# Altium project valves_v2.PrjPcb
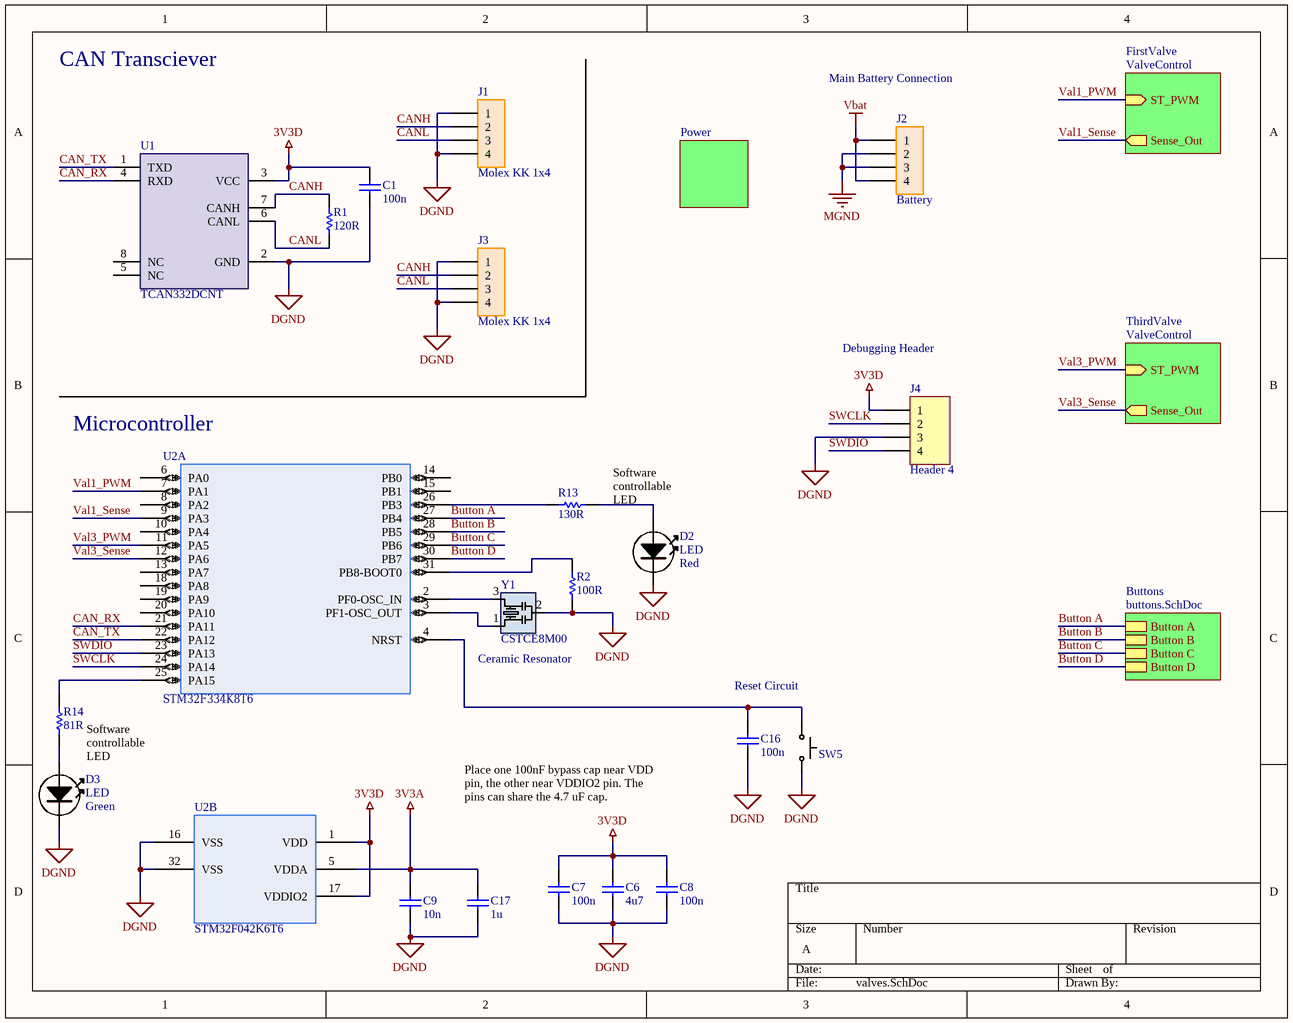
[diagram p0: valves.SchDoc]
4 sheets, 69 parts. Net scope: hierarchical (ports join the sheet entries above them; power ports are global).
Board file: valvePCB.PcbDoc
Sheets:
  valves.SchDoc
    FirstValve = ValveControl.SchDoc
    Designator = Power.SchDoc
    ThirdValve = ValveControl.SchDoc
    Buttons = buttons.SchDoc

## Sheet valves.SchDoc: PARSEC Valve Board
size A; Author: Lorenzo; DrawnBy: Lorenzo Shaikewitz; DocumentNumber: Valve Connections; Revision: A

### Parts
C1  value 100n  [C0805_med_density]  (hidden comment: CapCer)
C6  value 4u7  [C0603_med_density]  (hidden comment: CapCer)
C7  value 100n  [C0603_med_density]  (hidden comment: CapCer)
C8  value 100n  [C0603_med_density]  (hidden comment: CapCer)
C9  value 10n  [C0603_med_density]  (hidden comment: CapCer)
C16  value 100n  [C0805_med_density]  (hidden comment: CapCer)
C17  value 1u  [C0603_med_density]  (hidden comment: CapCer)
D2  LED  value Red  [LED0805]
D3  LED  value Green  [LED0805]
J1  Molex KK 1x4  [Molex KK 4x1]
J2  Battery  [CON_2074781004_MOL]
J3  Molex KK 1x4  [Molex KK 4x1]
J4  Header 4  [HDR1X4]
R1  value 120R  [R0805_med_density]  (hidden comment: ResChip)
R2  value 100R  [R0805_med_density]  (hidden comment: ResChip)
R13  value 130R  [R0603_med_density]  (hidden comment: ResChip)
R14  value 81R  [R0603_med_density]  (hidden comment: ResChip)
SW5  Switch  [PUSHBUTTON]  (value not drawn)
U1  TCAN332DCNT  [SOT-23-8]
U2  STM32F334K8T6‎  [LQFP-32]  (parts A,B of 2)
Y1  CSTCE8M00  [8MHz Ceramic Resonator]

### Sub-sheets
Buttons = buttons.SchDoc: Button B, Button C, Button D, Button A
Designator = Power: no entries
FirstValve = ValveControl: ST_PWM (in), Sense_Out (out)
ThirdValve = ValveControl: ST_PWM (in), Sense_Out (out)

### Nets
3V3A: C9.1 C17.1 U2.5(VDDA)
3V3D: C1.1 C6.2 C7.2 C8.2 J4.1 U1.3(VCC) U2.1(VDD) U2.17(VDDIO2)
DGND: C1.2 C6.1 C7.1 C8.1 C9.2 C16.1 C17.2 D2.K D3.K J1.1 J1.4 J3.1 J3.4 J4.3 R2.1 SW5.1 U1.2(GND) U2.16(VSS) U2.32(VSS) Y1.2(GND)
MGND: J2.2 J2.3
Vbat: J2.1 J2.4  [project net AMP_IN+]
Button A: U2.27(PB4) ; sheet Buttons/Button A
Button B: U2.28(PB5) ; sheet Buttons/Button B
Button C: U2.29(PB6) ; sheet Buttons/Button C
Button D: U2.30(PB7) ; sheet Buttons/Button D
CAN_RX: U1.4(RXD) U2.21(PA11)
CAN_TX: U1.1(TXD) U2.22(PA12)
CANH: J1.2 J3.2 R1.1 U1.7(CANH)
CANL: J1.3 J3.3 R1.2 U1.6(CANL)
SWCLK: J4.2 U2.24(PA14)
SWDIO: J4.4 U2.23(PA13)
Val1_PWM: U2.7(PA1) ; sheet FirstValve/ST_PWM
Val1_Sense: U2.9(PA3) ; sheet FirstValve/Sense_Out
Val3_PWM: U2.11(PA5) ; sheet ThirdValve/ST_PWM
Val3_Sense: U2.12(PA6) ; sheet ThirdValve/Sense_Out
NetC16_2: C16.2 SW5.2 U2.4(NRST)
NetD2_A: D2.A R13.1
NetD3_A: D3.A R14.1
NetR2_2: R2.2 U2.31(PB8-BOOT0)
NetR13_2: R13.2 U2.26(PB3)
NetR14_2: R14.2 U2.25(PA15)
NetU2_2: U2.2(PF0-OSC_IN) Y1.3(OSC2)
NetU2_3: U2.3(PF1-OSC_OUT) Y1.1(OSC1)

Not connected (* = marked no-connect by the designer): U1 5(NC) 8(NC); U2 6(PA0) 8(PA2) 10(PA4) 13(PA7) 14(PB0) 15(PB1) 18(PA8) 19(PA9) 20(PA10)

### Notes on the sheet
- CAN Transciever
- Main Battery Connection
- Debugging Header
- (near U2) Microcontroller
- Software controllable LED
- (near Y1) Ceramic Resonator
- Reset Circuit
- Place one 100nF bypass cap near VDD pin, the other near VDDIO2 pin. The pins can share the 4.7 uF cap.

### Library data of the parts
C1 C6-C9 C16 C17 = CapCer: SMD Ceramic Capacitor; Rating: 6.3V; Tolerance: *; EIA RS-198 Code: *; Package: *
D2 D3 = LED: Light-emitting diode; Package: *
J1 J3 = Molex KK 1x4: 1x4 Molex KK Connector (CAN)
J2 = 2074781004: Molex 1x4 11A Connector; Vendor: Molex Connector Corporation; Built_By: Molex_Team; SourceLibrary: Molex_2020-09-09; Manufacturer_Part_Number: 2074781004; Copyright: Copyright (C) 2018 Accelerated Designs. All rights reserved; RefDes: RefDes; Type: DEV
J4 = Header 4: Header, 4-Pin; LatestRevisionDate: 17-Jul-2002; LatestRevisionNote: Re-released for DXP Platform.; Publisher: Altium Limited
R1 R13 R14 = ResChip: SMD Chip resistor; Tolerance: *; Rating: *; Package: *
R2 = ResChip: SMD Chip resistor; Tolerance: 1%; Rating: *; Package: *
SW5 = Switch: Push button switch, momentary, normally open
U1 = TCAN332DCNT: IC TXRX CAN 3.3V SOT23-8
U2 = STM32F042K6T6: STM32 MCU; Vendor: STMicroelectronics; Built_By: EMA_UL_Team; SourceLibrary: Updates_to_database_2020-10-19; Manufacturer_Part_Number: STM32F334K8T6‎; Copyright: Copyright (C) 2018 Accelerated Designs. All rights reserved; RefDes: RefDes; Type: DEV
Y1 = CSTCE8M00: 8MHz Ceramic Resonator

## Sheet ValveControl.SchDoc
size A
Used 2 times, as channels FirstValve, ThirdValve. Parts and nets are listed once, with the designators drawn on the sheet.
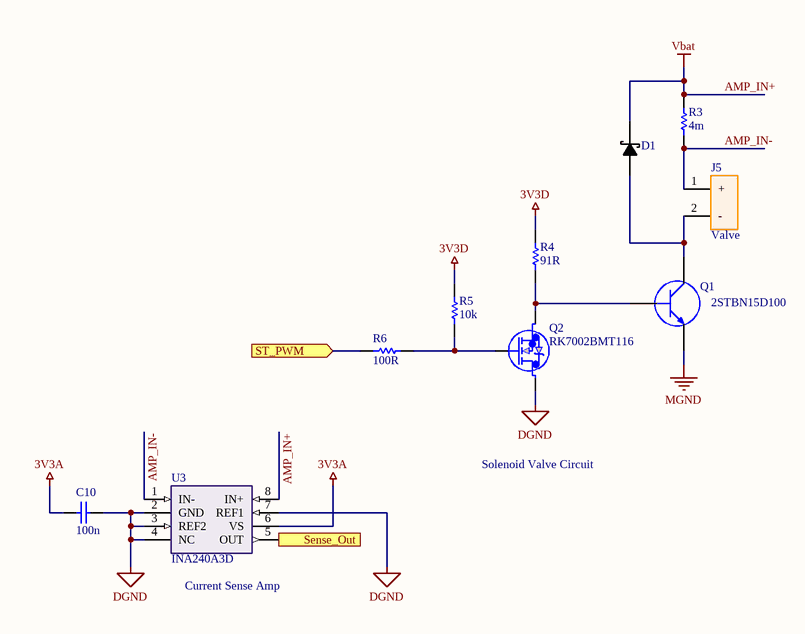
[diagram p1: ValveControl.SchDoc]

### Parts
C10  value 100n  [C0603_med_density]  (hidden comment: CapCer)
D1  1655-1921-1-ND  [DO-201AD]  (value not drawn)
J5  Valve  [MOLEX_436500200 - duplicate]
Q1  2STBN15D100  [D2PAK]
Q2  RK7002BMT116  [TRANS_RK7002BMHZG_ROM]
R3  value 4m  [R1210_med_density]  (hidden comment: ResChip)
R4  value 91R  [R0603_med_density]  (hidden comment: ResChip)
R5  value 10k  [R0603_med_density]  (hidden comment: ResChip)
R6  value 100R  [R0603_med_density]  (hidden comment: ResChip)
U3  INA240A3D  [INA240A3D]

### Ports
Sense_Out (out), ST_PWM (in)

### Nets
3V3A: C10.1 U3.6(VS)
3V3D: R4.1 R5.1
AMP_IN+: D1.2 R3.2 U3.8(IN+)  [also labelled Vbat]
DGND: C10.2 Q2.1 U3.2(GND) U3.3(REF2) U3.4(NC) U3.7(REF1)
MGND: Q1.3(B)
AMP_IN-: J5.1(+) R3.1 U3.1(IN-)
Sense_Out: U3.5(OUT) ; port Sense_Out
ST_PWM: R6.2 ; port ST_PWM
NetD1_1: D1.1 J5.2(-) Q1.1(B)
NetQ1_2: Q1.2(B) Q2.3 R4.2
NetQ2_2: Q2.2 R5.2 R6.1

### Channels
FirstValve: designators end in _FirstValve; ports Sense_Out=Val1_Sense ST_PWM=Val1_PWM
ThirdValve: designators end in _ThirdValve; ports Sense_Out=Val3_Sense ST_PWM=Val3_PWM

### Notes on the sheet
- Solenoid Valve Circuit
- (near U3) Current Sense Amp

### Library data of the parts
C10 = CapCer: SMD Ceramic Capacitor; Rating: 6.3V; Tolerance: *; EIA RS-198 Code: *; Package: *
D1 = DiodeSchottky: Schottky Diode; PartNumber: 1655-1921-1-ND; Package: *
J5 = General Molex
Q1 = BJT: 2STBN15D100 BJT; DC Gain: 750; Part Number: 2STBN15D100; Supplier 1: Digi-Key; Supplier Part Number 1: 497-10113-1-ND
Q2 = RK7002BMT116: n-channel MOSEFT; Vendor: ROHM Semiconductor; Built_By: EMA_Matt; SourceLibrary: Rohm_2019-09-23; Type: DEV; Manufacturer_Part_Number: RK7002BMT116; Copyright: Copyright (C) 2018 Accelerated Designs. All rights reserved; RefDes: RefDes
R3 = ResChip: SMD Chip resistor; Tolerance: 1%; Rating: 0.5W; Package: *
R4 = ResChip: SMD Chip resistor; Tolerance: 1%; Rating: 0.25 W; Package: *
R5 R6 = ResChip: SMD Chip resistor; Tolerance: *; Rating: *; Package: *
U3 = INA240A3D: SchLib for TI op amp for current sensing.; Supplier 1: Digi-Key; Supplier Part Number 1: 296-48839-ND

## Sheet Power.SchDoc
size A
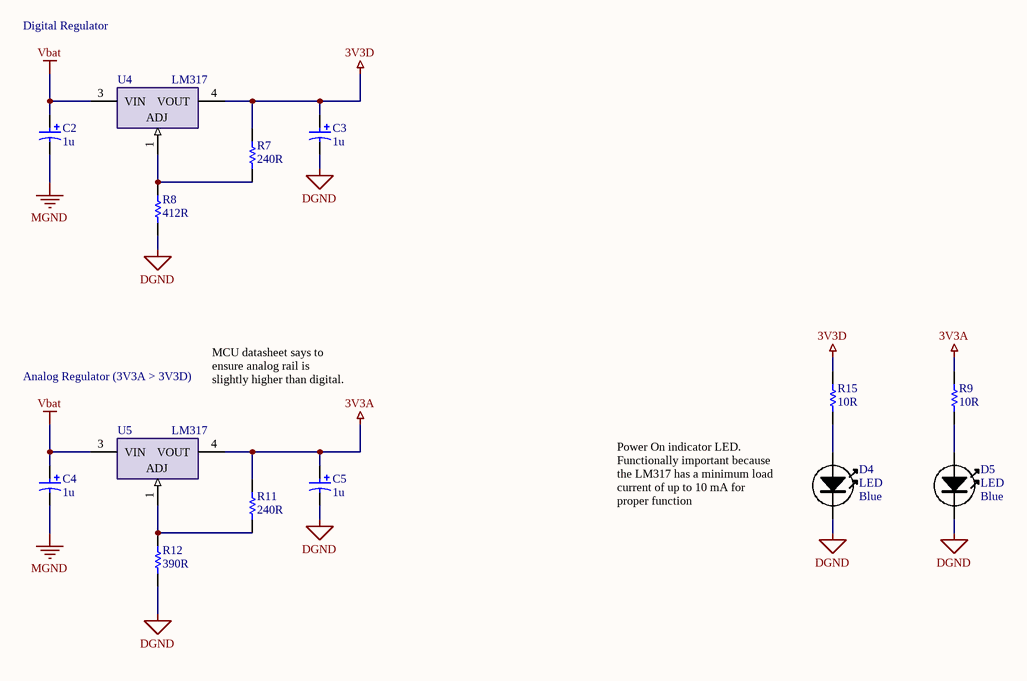
[diagram p2: Power.SchDoc]

### Parts
C2  value 1u  [C1206_tant_low_density]  (hidden comment: CapTant)
C3  value 1u  [C1206_tant_low_density]  (hidden comment: CapTant)
C4  value 1u  [C1206_tant_low_density]  (hidden comment: CapTant)
C5  value 1u  [C1206_tant_low_density]  (hidden comment: CapTant)
D4  LED  value Blue  [LED0805]
D5  LED  value Blue  [LED0805]
R7  value 240R  [R0805_med_density]  (hidden comment: ResChip)
R8  value 412R  [R0805_med_density]  (hidden comment: ResChip)
R9  value 10R  [R0805_med_density]  (hidden comment: ResChip)
R11  value 240R  [R0805_med_density]  (hidden comment: ResChip)
R12  value 390R  [R0805_med_density]  (hidden comment: ResChip)
R15  value 10R  [R0805_med_density]  (hidden comment: ResChip)
U4  LM317  [D-PAK]
U5  LM317  [D-PAK]

### Nets
3V3A: C5.1 R9.2 R11.2 U5.4(VOUT)
3V3D: C3.1 R7.2 R15.2 U4.4(VOUT)
DGND: C3.2 C5.2 D4.K D5.K R8.1 R12.1
MGND: C2.2 C4.2
Vbat: C2.1 C4.1 U4.3(VIN) U5.3(VIN)  [project net AMP_IN+]
NetD4_A: D4.A R15.1
NetD5_A: D5.A R9.1
NetR7_1: R7.1 R8.2 U4.1(ADJ)
NetR11_1: R11.1 R12.2 U5.1(ADJ)

### Notes on the sheet
- Digital Regulator
- Analog Regulator (3V3A > 3V3D)
- MCU datasheet says to ensure analog rail is slightly higher than digital.
- Power On indicator LED. Functionally important because the LM317 has a minimum load current of up to 10 mA for proper function

### Library data of the parts
C2-C5 = CapTant: Through-hole tantalum capacitor; Rating: 50V; Tolerance: *; Package: THD, 100mil pitch, 4.5mm diameter
D4 D5 = LED: Light-emitting diode; Package: *
R7 R8 R11 R12 = ResChip: SMD Chip resistor; Tolerance: 1%; Rating: *; Package: *
R9 R15 = ResChip: SMD Chip resistor; Tolerance: *; Rating: *; Package: *
U4 U5 = LM317: Linear Voltage Regulator

## Sheet buttons.SchDoc
size A
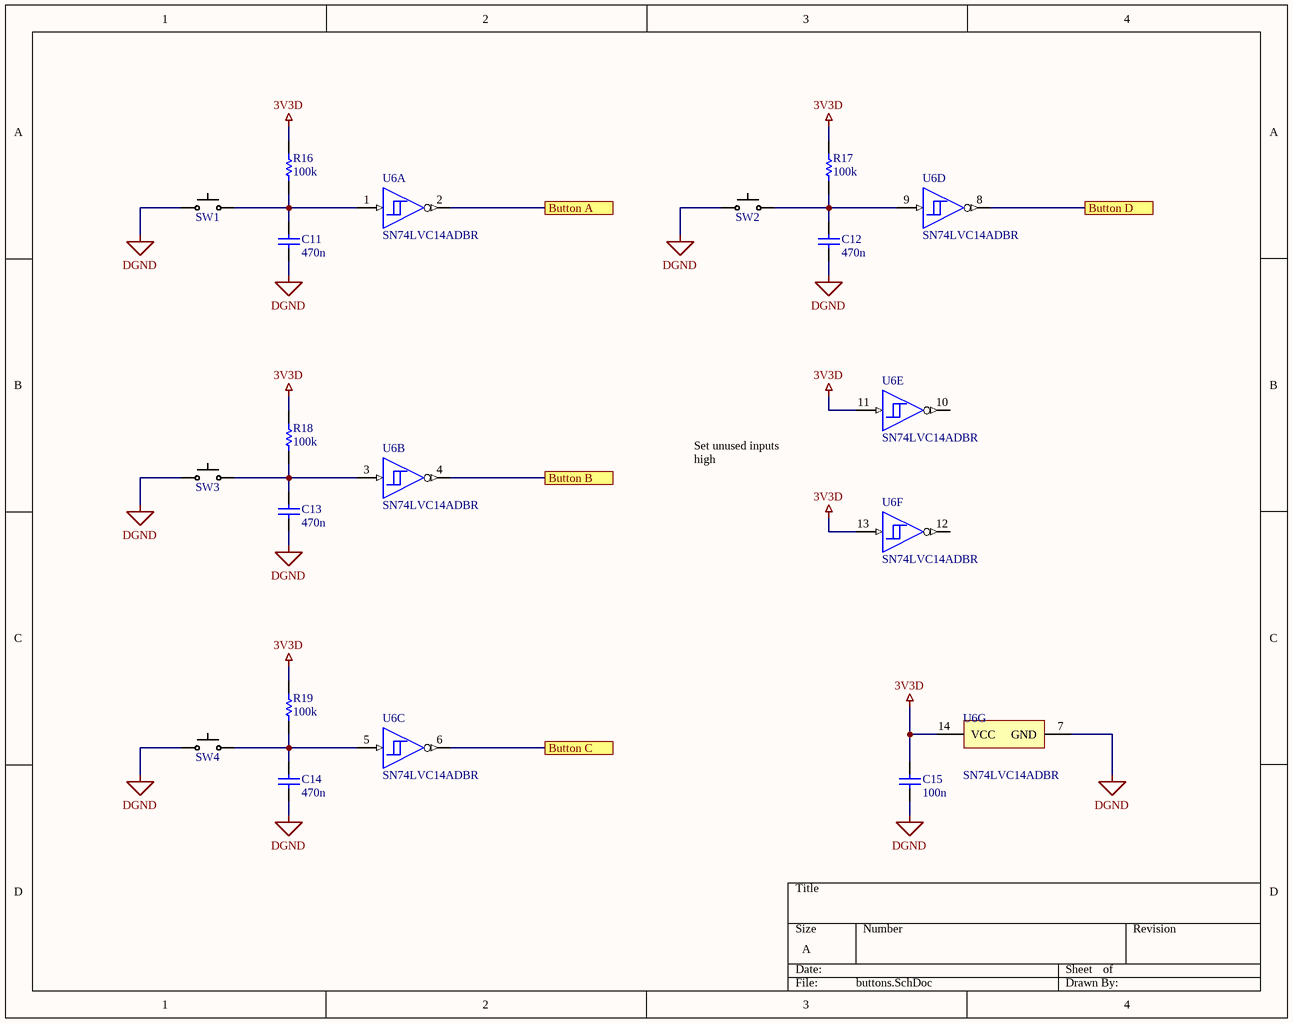
[diagram p3: buttons.SchDoc]

### Parts
C11  value 470n  [C0805_med_density]  (hidden comment: CapCer)
C12  value 470n  [C0805_med_density]  (hidden comment: CapCer)
C13  value 470n  [C0805_med_density]  (hidden comment: CapCer)
C14  value 470n  [C0805_med_density]  (hidden comment: CapCer)
C15  value 100n  [C0805_med_density]  (hidden comment: CapCer)
R16  value 100k  [R0805_med_density]  (hidden comment: ResChip)
R17  value 100k  [R0805_med_density]  (hidden comment: ResChip)
R18  value 100k  [R0805_med_density]  (hidden comment: ResChip)
R19  value 100k  [R0805_med_density]  (hidden comment: ResChip)
SW1  Switch  [PUSHBUTTON]  (value not drawn)
SW2  Switch  [PUSHBUTTON]  (value not drawn)
SW3  Switch  [PUSHBUTTON]  (value not drawn)
SW4  Switch  [PUSHBUTTON]  (value not drawn)
U6  SN74LVC14ADBR  [SOP-14]  (parts A,B,C,D,E,F,G of 7)

### Ports
Button A, Button B, Button C, Button D

### Nets
3V3D: C15.1 R16.2 R17.2 R18.2 R19.2 U6.11(5A) U6.13(6A) U6.14(VCC)
DGND: C11.2 C12.2 C13.2 C14.2 C15.2 SW1.2 SW2.2 SW3.2 SW4.2 U6.7(GND)
Button A: U6.2(~{1Y}) ; port Button A
Button B: U6.4(~{2Y}) ; port Button B
Button C: U6.6(~{3Y}) ; port Button C
Button D: U6.8(~{4Y}) ; port Button D
NetC11_1: C11.1 R16.1 SW1.1 U6.1(1A)
NetC12_1: C12.1 R17.1 SW2.1 U6.9(4A)
NetC13_1: C13.1 R18.1 SW3.1 U6.3(2A)
NetC14_1: C14.1 R19.1 SW4.1 U6.5(3A)

Not connected (* = marked no-connect by the designer): U6 10(~{5Y}) 12(~{6Y})

### Notes on the sheet
- Set unused inputs high

### Library data of the parts
C11-C15 = CapCer: SMD Ceramic Capacitor; Rating: 6.3V; Tolerance: *; EIA RS-198 Code: *; Package: *
R16-R19 = ResChip: SMD Chip resistor; Tolerance: *; Rating: *; Package: *
SW1-SW4 = Switch: as SW5 on sheet valves
U6 = SN74LVC14: Hex Schmitt-Trigger Inverter, DB0014A, LARGE T&R; Manufacturer: Texas Instruments; tpd @ Nom Voltage(Max)(ns): 11,7.8,7.5,6.4; Output Type: CMOS; Voltage(Nom)(V): 1.8,2.5,2.7,3.3; F @ Nom Voltage(Max)(Mhz): 100; ICC @ Nom Voltage(Max)(mA): 0.01; Input Type: CMOS,TTL; VCC(Max)(V): 3.6; Schmitt Trigger: Yes; Technology Family: LVC; VCC(Min)(V): 2; Output Drive (IOL/IOH)(Max)(mA): -24/24; Bits(#): 6; Rating: Catalog; Code_JEDEC: MO-150; PackageReference: DB0014A; Generic Part Number: SN74LVC14A; Operating Temperature Range(C): -40 to 125; DatasheetVersion: SCAS285AA

## Nets that join several sheets
3V3A: valves (C9.1 C17.1 U2.5), FirstValve (C10_FirstValve.1 U3_FirstValve.6), Power (C5.1 R9.2 R11.2 U5.4), ThirdValve (C10_ThirdValve.1 U3_ThirdValve.6)
3V3D: valves (8 pins), FirstValve (R4_FirstValve.1 R5_FirstValve.1), Power (C3.1 R7.2 R15.2 U4.4), ThirdValve (R4_ThirdValve.1 R5_ThirdValve.1), buttons (8 pins)
AMP_IN+: valves (J2.1 J2.4), FirstValve (D1_FirstValve.2 R3_FirstValve.2 U3_FirstValve.8), Power (C2.1 C4.1 U4.3 U5.3), ThirdValve (D1_ThirdValve.2 R3_ThirdValve.2 U3_ThirdValve.8)
DGND: valves (20 pins), FirstValve (6 pins), Power (6 pins), ThirdValve (6 pins), buttons (10 pins)
MGND: valves (J2.2 J2.3), FirstValve (Q1_FirstValve.3), Power (C2.2 C4.2), ThirdValve (Q1_ThirdValve.3)
Button A: valves (U2.27), buttons (U6.2)
Button B: valves (U2.28), buttons (U6.4)
Button C: valves (U2.29), buttons (U6.6)
Button D: valves (U2.30), buttons (U6.8)
Val1_PWM: valves (U2.7), FirstValve (R6_FirstValve.2)
Val1_Sense: valves (U2.9), FirstValve (U3_FirstValve.5)
Val3_PWM: valves (U2.11), ThirdValve (R6_ThirdValve.2)
Val3_Sense: valves (U2.12), ThirdValve (U3_ThirdValve.5)